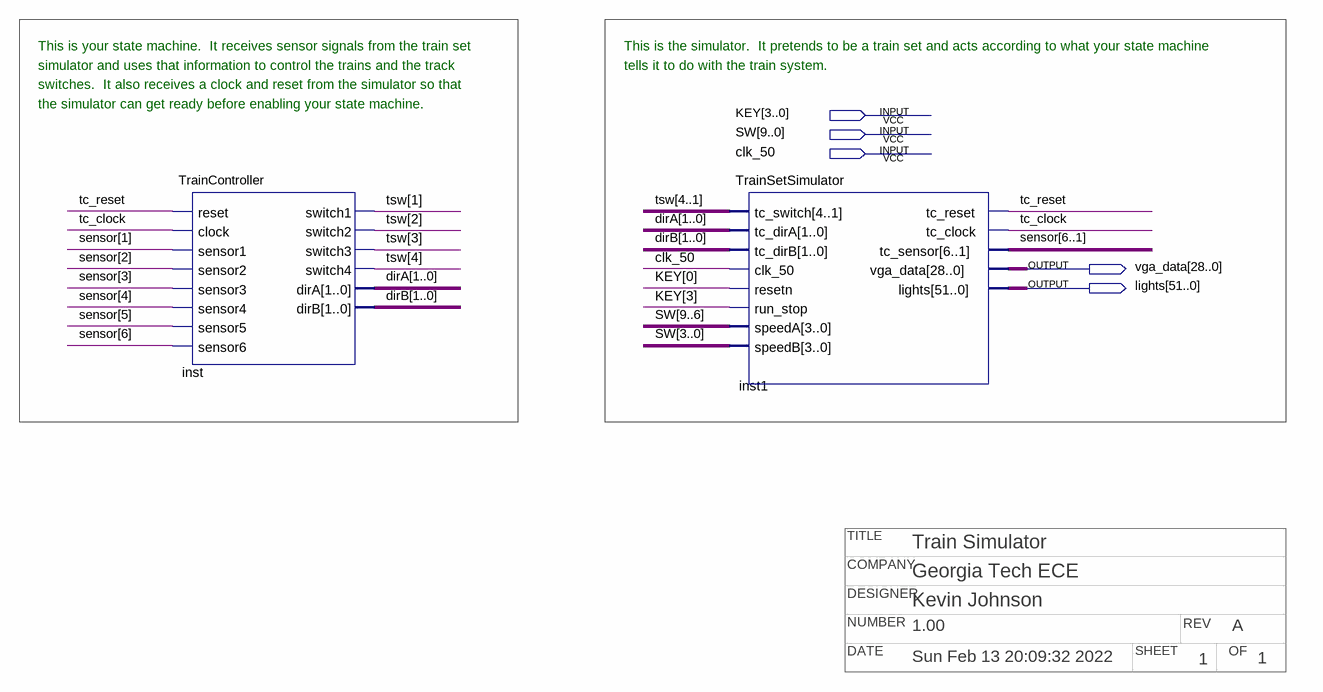
[diagram p0: schematic sheet]
// Quartus schematic TrainTop.bdf as structural Verilog: 2 symbols, 5 pins
// Title block: COMPANY: Georgia Tech ECE; DATE: Sun Feb 13 20:09:32 2022; DESIGNER: Kevin Johnson; NUMBER: 1.00; OF: 1; REV: A; SHEET: 1; TITLE: Train Simulator
module TrainTop (
  input  [3:0] KEY,
  input  [9:0] SW,
  input  clk_50,
  output [28:0] vga_data,
  output [51:0] lights
);

  wire tc_clock, tc_reset;
  wire [1:0] dirA, dirB;
  wire [4:1] tsw;
  wire [6:1] sensor;

  TrainController inst (
    .reset(tc_reset), .clock(tc_clock), .sensor1(sensor[1]), .sensor2(sensor[2]), .sensor3(sensor[3]),
    .sensor4(sensor[4]), .sensor5(sensor[5]), .sensor6(sensor[6]), .switch1(tsw[1]), .switch2(tsw[2]),
    .switch3(tsw[3]), .switch4(tsw[4]), .dirA(dirA), .dirB(dirB));
  TrainSetSimulator inst1 (
    .tc_switch(tsw), .tc_dirA(dirA), .tc_dirB(dirB), .clk_50(clk_50), .resetn(KEY[0]), .run_stop(KEY[3]),
    .speedA(SW[9:6]), .speedB(SW[3:0]), .tc_reset(tc_reset), .tc_clock(tc_clock), .tc_sensor(sensor),
    .vga_data(vga_data), .lights(lights));

  // Notes on the sheet:
  //   This is your state machine.  It receives sensor signals from the train set
  //   This is the simulator.  It pretends to be a train set and acts according to what your state machine
  //   simulator and uses that information to control the trains and the track
  //   tells it to do with the train system.
  //   switches.  It also receives a clock and reset from the simulator so that
  //   the simulator can get ready before enabling your state machine.
endmodule
